# Altium schematic sheet loratea_new.SchDoc: Seeed IoTea
size A; DrawnBy: Yuxiang_Liu; Revision: v1.2; Time: 20/07/2018
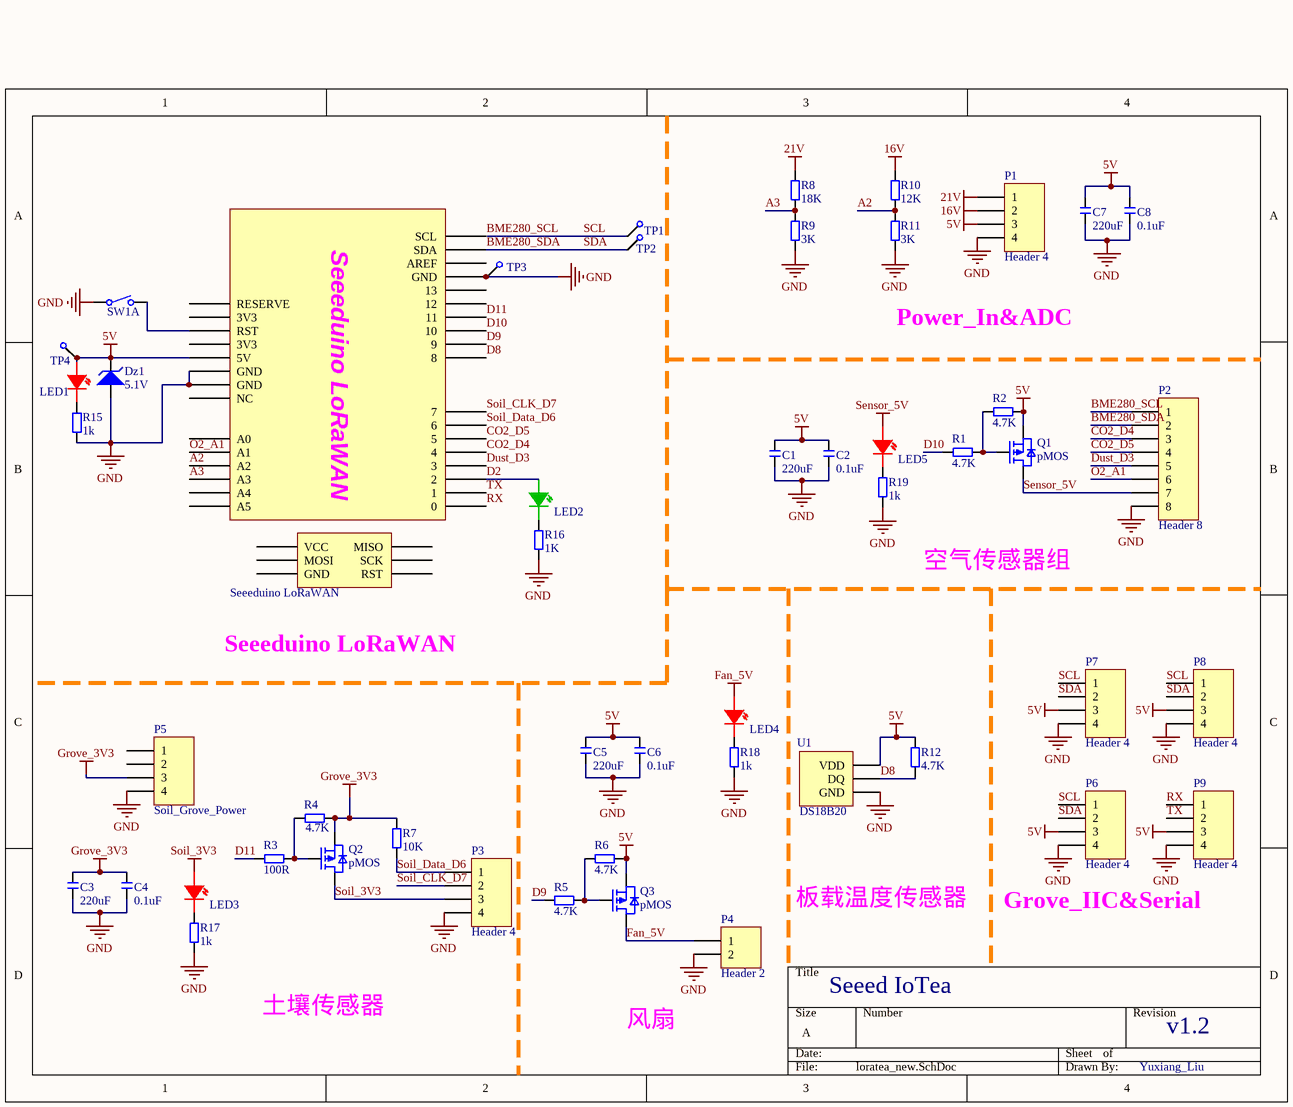
[diagram p0: loratea_new.SchDoc]

## Parts
C1  220uF  [C3528]
C2  0.1uF  [C0805]
C3  220uF  [C3528]
C4  0.1uF  [C0805]
C5  220uF  [C3528]
C6  0.1uF  [C0805]
C7  220uF  [C3528]
C8  0.1uF  [C0805]
Dz1  value 5.1V  [DIODE-0.2-SMD]  (hidden comment: Diode-Zener)
LED1  LED-R  [LED0805]  (value not drawn)
LED2  LED  [LED0805G]  (value not drawn)
LED3  LED-R  [LED0805R]  (value not drawn)
LED4  LED-R  [LED0805R]  (value not drawn)
LED5  LED-R  [LED0805R]  (value not drawn)
P1  Header 4  [2EDG3.81-4P]
P2  Header 8  [2EDG3.81-8P]
P3  Header 4  [2EDG3.81-4P]
P4  Header 2  [2EDG3.81-2P]
P5  Soil_Grove_Power  [PH2.0-4]
P6  Header 4  [PH2.0-4]
P7  Header 4  [PH2.0-4]
P8  Header 4  [PH2.0-4]
P9  Header 4  [2EDG3.81-4P]
Q1  pMOS  [AO3415]
Q2  pMOS  [AO3415]
Q3  pMOS  [AO3415]
R1  value 4.7K  [R0805]  (hidden comment: 100R)
R2  value 4.7K  [R0805]  (hidden comment: 100R)
R3  100R  [R0805]
R4  value 4.7K  [R0805]  (hidden comment: 100R)
R5  value 4.7K  [R0805]  (hidden comment: 100R)
R6  value 4.7K  [R0805]  (hidden comment: 100R)
R7  value 10K  [R0805]  (hidden comment: 100R)
R8  18K  [R0805]
R9  3K  [R0805]
R10  12K  [R0805]
R11  3K  [R0805]
R12  4.7K  [R0805]
R15  1k  [R0805]
R16  1K  [R0805]
R17  1k  [Axial-0.1-2.54]
R18  1k  [R0805]
R19  1k  [R0805]
Seeeduino_LoRaWAN  Seeeduino LoRaWAN  [Seeeduino LoRaWAN]  (value not drawn)
SW1  SW-3s  [KEY6X6SMD]  (value not drawn)  (part A of 3)
TP1  TestPoint  [TP]  (value not drawn)
TP2  TestPoint  [TP]  (value not drawn)
TP3  TestPoint  [TP]  (value not drawn)
TP4  TestPoint  [TP]  (value not drawn)
U1  DS18B20  [TO92C]

## Nets
5V: C1.1 C2.2 C5.1 C6.2 C7.1 C8.2 Dz1.2 LED1.1 P1.3 P6.3 P7.3 P8.3 P9.3 Q1.S Q3.S R2.2 R6.2 R12.2 Seeeduino_LoRaWAN.5V TP4.1 U1.3(VDD)
16V: P1.2 R10.2
21V: P1.1 R8.2
Fan_5V: LED4.1 P4.1 Q3.D
GND: C1.2 C2.1 C3.2 C4.1 C5.2 C6.1 C7.2 C8.1 Dz1.1 P1.4 P2.8 P3.4 P4.2 P5.4 P6.4 P7.4 P8.4 P9.4 R9.1 R11.1 R15.1 R16.1 R17.1 R18.1 R19.1 Seeeduino_LoRaWAN.GND SW1.1 TP3.1 U1.1(GND)
Grove_3V3: C3.1 C4.2 P5.3 Q2.S R4.2 R7.2
Sensor_5V: LED5.1 P2.7 Q1.D
Soil_3V3: LED3.1 P3.3 Q2.D
A2: R10.1 R11.2 Seeeduino_LoRaWAN.A2
A3: R8.1 R9.2 Seeeduino_LoRaWAN.A3
BME280_SCL: P2.1 Seeeduino_LoRaWAN.SCL
BME280_SDA: P2.2 P6.2 P7.2 P8.2 Seeeduino_LoRaWAN.SDA TP2.1  [also labelled SDA]
CO2_D4: P2.3 Seeeduino_LoRaWAN.4
CO2_D5: P2.4 Seeeduino_LoRaWAN.5
D2: LED2.1 Seeeduino_LoRaWAN.2
D8: R12.1 Seeeduino_LoRaWAN.8 U1.2(DQ)
D9: R5.1 Seeeduino_LoRaWAN.9
D10: R1.1 Seeeduino_LoRaWAN.10
D11: R3.1 Seeeduino_LoRaWAN.7(11)
Dust_D3: P2.5 Seeeduino_LoRaWAN.3
O2_A1: P2.6 Seeeduino_LoRaWAN.A1
RX: P9.1 Seeeduino_LoRaWAN.0
SCL: P6.1 P7.1 P8.1 TP1.1
Soil_CLK_D7: P3.2 Seeeduino_LoRaWAN.7
Soil_Data_D6: P3.1 R7.1 Seeeduino_LoRaWAN.6
TX: P9.2 Seeeduino_LoRaWAN.1
NetLED1_2: LED1.2 R15.2
NetLED2_2: LED2.2 R16.2
NetLED3_2: LED3.2 R17.2
NetLED4_2: LED4.2 R18.2
NetLED5_2: LED5.2 R19.2
NetQ1_G: Q1.G R1.2 R2.1
NetQ2_G: Q2.G R3.2 R4.1
NetQ3_G: Q3.G R5.2 R6.1
NetSeeeduino_LoRaWAN_RST: Seeeduino_LoRaWAN.RST SW1.2

Not connected (* = marked no-connect by the designer): P5 1 2; Seeeduino_LoRaWAN 3V3 12 13 A0 A4 A5 AREF MISO MOSI NC RESERVE SCK VCC

## Notes on the sheet
- Power_In&ADC
- 空气传感器组
- (near Q1) 本次选用SI2301栅极开启电压VGH 最小值是-0.5V  最大值是-1.5V 。
  关断时，单片机输出3.3V，R1和R2选择为4.7K是为了保证栅源电压在容限内
- Seeeduino LoRaWAN
- 板载温度传感器
- Grove_IIC&Serial
- 土壤传感器
- 风扇

## Library data of the parts
C1-C8 = Cap: 无极电容
  C1 C3 C5 C7: Value: 220uF
  C2 C4 C6 C8: Value: 0.1uF
Dz1 = Diode-Zener: 稳压二极管
LED1 LED3-LED5 = LED-R: 红色发光二极管
LED2 = LED: 绿色发光二极管
P1 P3 P5-P9 = Header 4: Header, 4-Pin; LatestRevisionDate: 17-Jul-2002; LatestRevisionNote: Re-released for DXP Platform.; Publisher: Altium Limited
P2 = Header 8: Header, 8-Pin; LatestRevisionDate: 17-Jul-2002; LatestRevisionNote: Re-released for DXP Platform.; Publisher: Altium Limited
P4 = Header 2: Header, 2-Pin; LatestRevisionDate: 17-Jul-2002; LatestRevisionNote: Re-released for DXP Platform.; Publisher: Altium Limited
Q1-Q3 = pMOS-FET: 增强型P沟道金属氧化物半导体场效应晶体管
R1-R12 R15-R19 = RES: 电阻  RES
  R3: Value: 100R
  R8: Value: 18K
  R9 R11: Value: 3K
  R10: Value: 12K
  R12: Value: 4.7K
  R15 R17-R19: Value: 1k
  R16: Value: 1K
SW1 = SW-3s: 开关排，3位
TP1-TP4 = TestPoint: 一个测试点
U1 = DS18B20: 单总线温度传感器